# Altium schematic sheet 3V3_MCU_SUPPLY.SchDoc
size A4; SheetNumber: 6; SheetTotal: 12
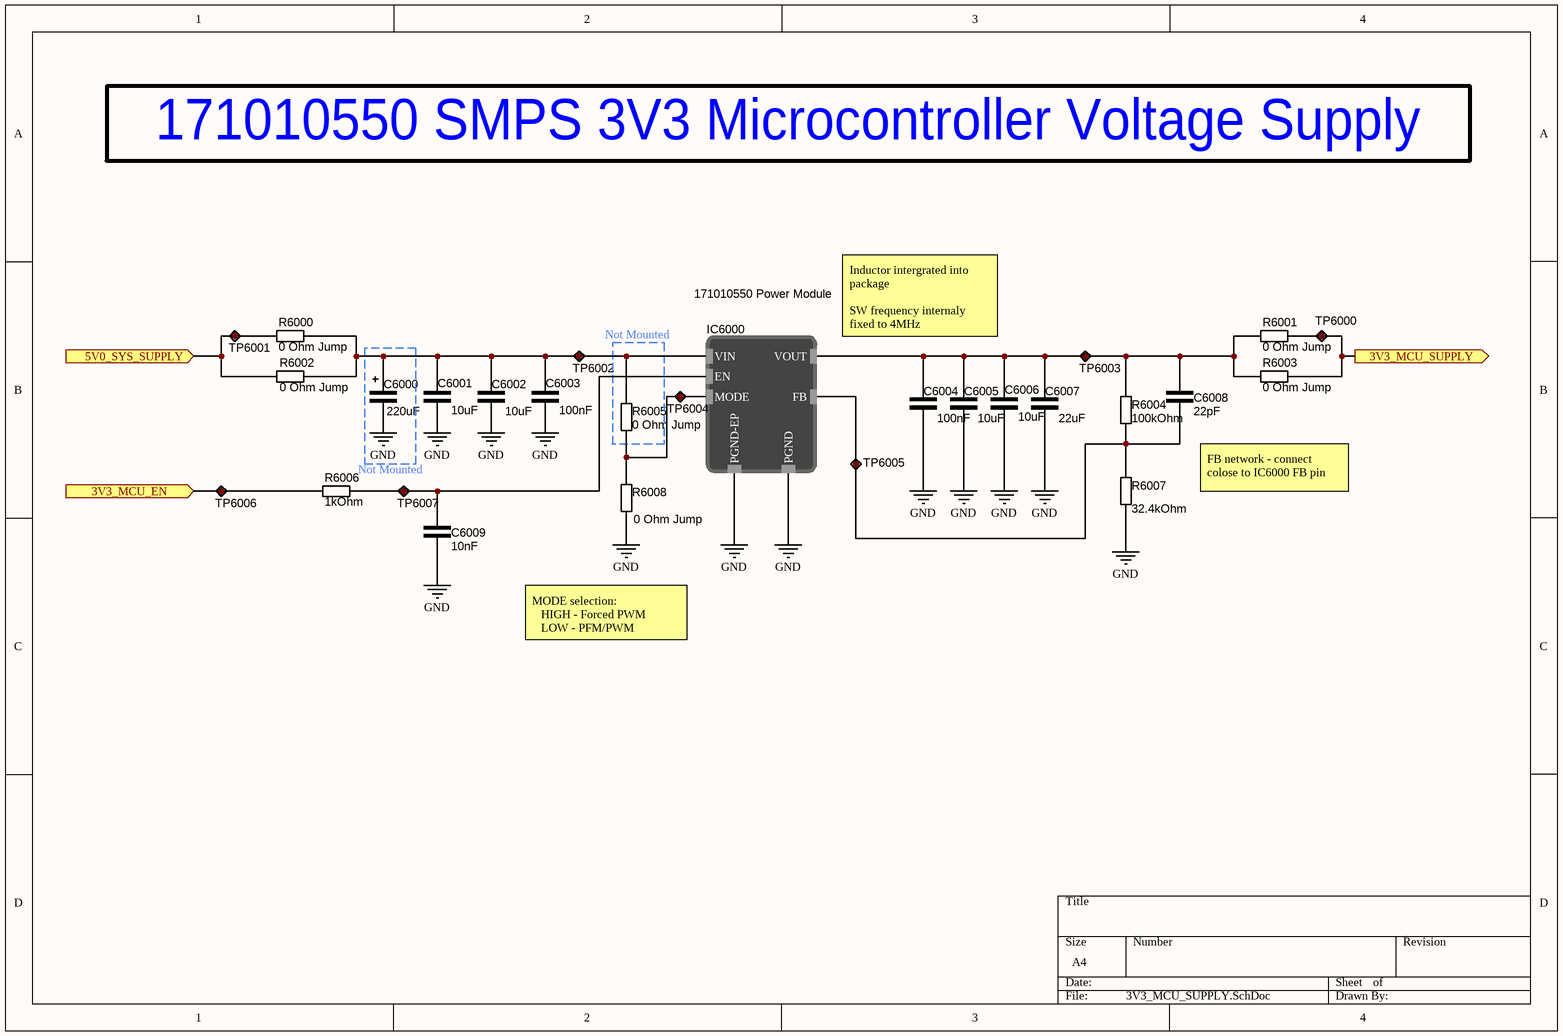
[diagram p0: 3V3_MCU_SUPPLY.SchDoc]

## Parts
C6000  220uF  [CAPAE9083X100M]
C6001  10uF  [CAP_0805]
C6002  10uF  [CAP_0805]
C6003  100nF  [CAP_0603]
C6004  100nF  [CAP_0603]
C6005  10uF  [CAP_0805]
C6006  10uF  [CAP_0805]
C6007  22uF  [CAP_0805]
C6008  22pF  [CAP_0603]
C6009  10nF  [CAP_0603]
IC6000  171010550 Power Module  [171010550]
R6000  0 Ohm Jump  [RES_0603]
R6001  0 Ohm Jump  [RES_0805]
R6002  0 Ohm Jump  [RES_0603]
R6003  0 Ohm Jump  [RES_0805]
R6004  100kOhm  [RES_0603]
R6005  0 Ohm Jump  [RES_0603]
R6006  1kOhm  [RES_0603]
R6007  32.4kOhm  [RES_0603]
R6008  0 Ohm Jump  [RES_0603]
TP6000  Test point  [TestPoint]  (value not drawn)
TP6001  Test point  [TestPoint]  (value not drawn)
TP6002  Test point  [TestPoint]  (value not drawn)
TP6003  Test point  [TestPoint]  (value not drawn)
TP6004  Test point  [TestPoint]  (value not drawn)
TP6005  Test point  [TestPoint]  (value not drawn)
TP6006  Test point  [TestPoint]  (value not drawn)
TP6007  Test point  [TestPoint]  (value not drawn)

## Ports
3V3_MCU_EN (in, see 6DOF_CONTROLLER_Top[5A]), 3V3_MCU_SUPPLY (out, see 6DOF_CONTROLLER_Top[5A]), 5V0_SYS_SUPPLY (in, see 6DOF_CONTROLLER_Top[5A], 3V3_SYS_SUPPLY[1B], 5V_SYS_SUPPLY[8A])

## Nets
GND: C6004.1 C6005.1 C6006.2 C6007.2 C6009.1 IC6000.5(PGND) IC6000.EP(PGND-EP) R6007.1 R6008.1
3V3_MCU_EN: R6006.1 TP6006.1 ; port 3V3_MCU_EN
3V3_MCU_SUPPLY: R6001.2 R6003.2 TP6000.1 ; port 3V3_MCU_SUPPLY
5V0_SYS_SUPPLY: R6000.1 R6002.2 TP6001.1 ; port 5V0_SYS_SUPPLY
NetC6000_2: C6000.2 C6001.1 C6002.2 C6003.1 IC6000.4(VIN) R6000.2 R6002.1 R6005.2 TP6002.1
NetC6004_2: C6004.2 C6005.2 C6006.1 C6007.1 C6008.2 IC6000.6(VOUT) R6001.1 R6003.1 R6004.2 TP6003.1
NetC6008_1: C6008.1 IC6000.1(FB) R6004.1 R6007.2 TP6005.1
NetC6009_2: C6009.2 IC6000.3(EN) R6006.2 TP6007.1
NetIC6000_2: IC6000.2(MODE) R6005.1 R6008.2 TP6004.1

Not connected (* = marked no-connect by the designer): C6000 1; C6001 2; C6002 1; C6003 2

## Notes on the sheet
- 171010550 SMPS 3V3 Microcontroller Voltage Supply
- Not Mounted
- (near IC6000) Inductor intergrated into package
  SW frequency internaly fixed to 4MHz
- FB network - connect colose to IC6000 FB pin
- MODE selection:
  HIGH - Forced PWM
  LOW - PFM/PWM
- Labels drawn without touching a wire or pin: GND

## Library data of the parts
C6000 = C000025: 220 µF 10 V Aluminum - Polymer Capacitors Radial, Can - SMD 20mOhm 2000 Hrs @ 105°C; ComponentLink1Description: DigiKey; ComponentLink1URL: https://www.digikey.com/en/products/detail/kemet/A765KN227M1ALAE020/6196558; DigiKey Part Number: 399-A765KN227M1ALAE020CT-ND; capacitance: 220uF
C6001 C6002 C6005 C6006 = C000002: 10 µF ±10% 25V Ceramic Capacitor X5R 0805 (2012 Metric); ComponentLink1Description: DigiKey; ComponentLink1URL: https://www.digikey.com/en/products/detail/tdk-corporation/C2012X5R1E106K125AB/2443462; DigiKey Part Number: 445-5984-1-ND; capacitance: 10uF
C6003 C6004 = C000007: 0.1 µF ±10% 25V Ceramic Capacitor X7R 0603 (1608 Metric); ComponentLink1Description: DigiKey; ComponentLink1URL: https://www.digikey.com/en/products/detail/kyocera-avx/06033C104K4T2A/8019250; DigiKey Part Number: 478-KAM15AR71E104KTCT-ND; capacitance: 100nF
C6007 = C000001: 22 µF ±20% 25V Ceramic Capacitor X5R 0805 (2012 Metric); ComponentLink1Description: DigiKey; ComponentLink1URL: https://www.digikey.com/en/products/detail/tdk-corporation/C2012X5R1E226M125AC/3661564; DigiKey Part Number: 445-9112-1-ND; capacitance: 22uF
C6008 = C000024: 22 pF ±10% 25V Ceramic Capacitor X7R 0603 (1608 Metric); ComponentLink1Description: DigiKey; ComponentLink1URL: https://www.digikey.com/en/products/detail/kemet/C0603C220K3RACAUTO/16524857; DigiKey Part Number: 399-C0603C220K3RACAUTOCT-ND; capacitance: 22pF
C6009 = C000005: 10000 pF ±20% 25V Ceramic Capacitor X7R 0603 (1608 Metric); ComponentLink1Description: DigiKey; ComponentLink1URL: https://www.digikey.com/en/products/detail/kyocera-avx/06033C103MAT2A/1599370; DigiKey Part Number: 478-KGM15AR71E103MTCT-ND; capacitance: 10nF
IC6000 = 171010550: Non-Isolated PoL Module DC DC Converter 1 Output 0.8 ~ 5.5V 1.2A 2.5V - 5.5V Input; DigiKey Part Number: 732-171010550CT-ND; Mouser Part Number: 710-171010550; ComponentLink1Description: DigiKey; ComponentLink1URL: https://www.digikey.com/en/products/detail/w%C3%BCrth-elektronik/171010550/10468263; ComponentLink2Description: Mouser; ComponentLink2URL: https://eu.mouser.com/ProductDetail/Wurth-Elektronik/171010550?qs=d0WKAl%252BL4KaovukkXP8RVA%3D%3D
R6000 R6002 R6005 R6008 = R000007: 0 Ohms Jumper Chip Resistor 0603 (1608 Metric) Automotive AEC-Q200 Thick Film; ComponentLink1Description: DigiKey; ComponentLink1URL: https://www.digikey.com/en/products/detail/stackpole-electronics-inc/RMCF0603ZT0R00/1756908; resistance: 0 Ohm Jump; DigiKey Part Number: RMCF0603ZT0R00CT-ND
R6001 R6003 = R000011: 0 Ohms Jumper Chip Resistor 0805 (2012 Metric) Automotive AEC-Q200 Thick Film; ComponentLink1Description: DigiKey; ComponentLink1URL: https://www.digikey.com/en/products/detail/panasonic-electronic-components/ERJ-6GEY0R00V/78163; resistance: 0 Ohm Jump; DigiKey Part Number: P0.0ACT-ND
R6004 = R000006: 100 kOhms ±1% 0.1W, 1/10W Chip Resistor 0603 (1608 Metric) Automotive AEC-Q200 Thick Film; resistance: 100kOhm; ComponentLink1Description: DigiKey; ComponentLink1URL: https://www.digikey.com/en/products/detail/stackpole-electronics-inc/RMCF0603FG100K/1713543; DigiKey Part Number: RMCF0603FG100KCT-ND
R6006 = R000004: 1 kOhms ±1% 0.125W, 1/8W Chip Resistor 0603 (1608 Metric) Anti-Sulfur Thin Film; resistance: 1kOhm; ComponentLink1Description: DigiKey; ComponentLink1URL: https://www.digikey.com/en/products/detail/vishay-beyschlag-draloric-bc-components/MCT06030C1001FP500/2607821; DigiKey Part Number: MCT0603-1.00K-CFCT-ND
R6007 = R000014: 32.4 kOhms ±1% 0.1W, 1/10W Chip Resistor 0603 (1608 Metric) Moisture Resistant Thick Film; ComponentLink1Description: DigiKey; ComponentLink1URL: https://www.digikey.com/en/products/detail/bourns-inc/CR0603-FX-3242ELF/3783945; resistance: 32.4kOhm; DigiKey Part Number: CR0603-FX-3242ELFCT-ND
TP6000-TP6007 = TP002: Test point 1mm